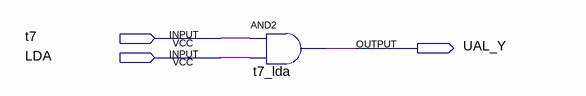
[diagram p0: schematic sheet]
// Quartus schematic ual_y.bdf as structural Verilog: 1 symbols, 3 pins
module ual_y (
  input  t7,
  input  LDA,
  output UAL_Y
);

  and t7_lda (UAL_Y, t7, LDA);
endmodule
